# Altium schematic sheet RF.SchDoc
size A4
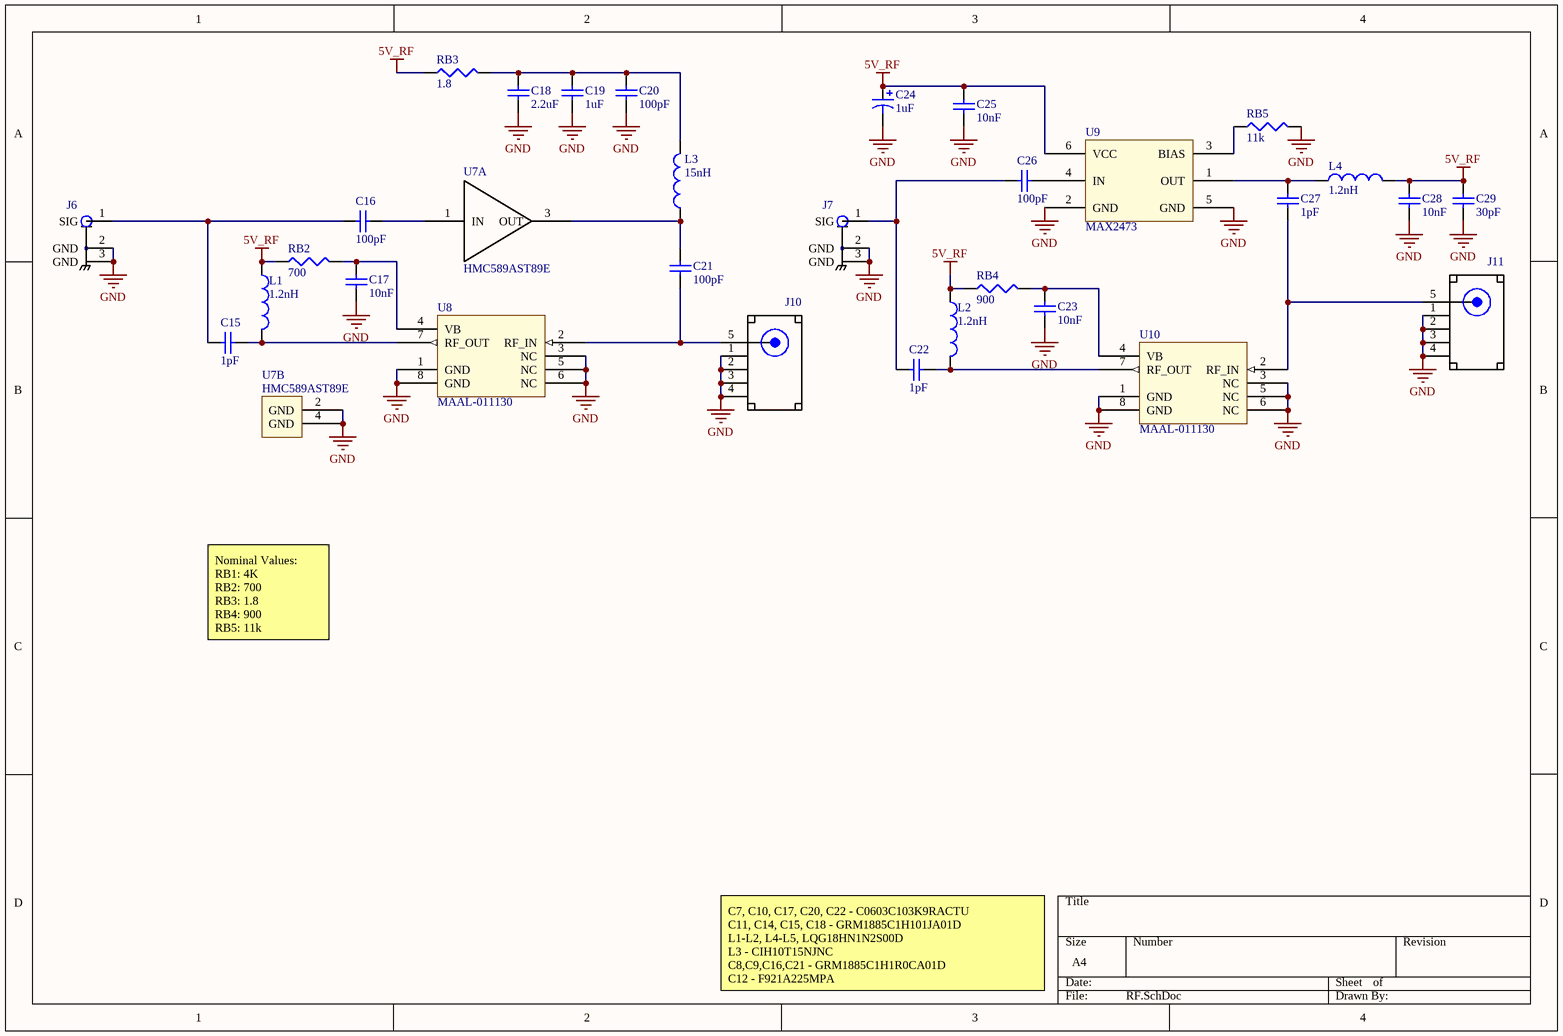
[diagram p0: RF.SchDoc]

## Parts
C15  1pF  [CAPC1608X90X35LL10T15]
C16  100pF  [CAPC0603(1608)100_N]
C17  10nF  [CAPC0603(1608)100_L]
C18  2.2uF  [C1206]
C19  1uF  [CAPC0603(1608)100_N]
C20  100pF  [CAPC0603(1608)100_N]
C21  100pF  [CAPC0603(1608)100_N]
C22  1pF  [CAPC1608X90X35LL10T15]
C23  10nF  [CAPC0603(1608)100_L]
C24  1uF  [CAPAE430X550N]
C25  10nF  [CAPC0603(1608)100_L]
C26  100pF  [CAPC0603(1608)100_N]
C27  1pF  [CAPC1608X90X35LL10T15]
C28  10nF  [CAPC0603(1608)100_L]
C29  30pF  [CAPC1608X90X35LL15T15]
J6  1909763-1  [TE_1909763-1]  (value not drawn)
J7  1909763-1  [TE_1909763-1]  (value not drawn)
J10  5-1814400-1  [CONN_5-1814400-1]  (value not drawn)
J11  5-1814400-1  [CONN_5-1814400-1]  (value not drawn)
L1  1.2nH  [INDC1608L]
L2  1.2nH  [INDC1608L]
L3  15nH  [INDC1608L]
L4  1.2nH  [INDC1608L]
RB2  700  [J1-0603]
RB3  1.8  [J1-0603]
RB4  900  [C1206]
RB5  11k  [J1-0603]
U7  HMC589AST89E  [SOT150P410X160-3N]  (parts A,B of 2)
U8  MAAL-011130  [PQFN50P200X200X100_HS-9N]
U9  MAX2473  [SOT95P280X145-6N]
U10  MAAL-011130  [PQFN50P200X200X100_HS-9N]

## Nets
5V_RF: C24.1 C25.2 C28.2 C29.2 L1.2 L2.2 L4.1 RB2.2 RB3.2 RB4.2 U9.6(VCC)
GND: C17.1 C18.1 C19.2 C20.2 C23.1 C24.2 C25.1 C28.1 C29.1 J6.2(GND) J6.3(GND) J7.2(GND) J7.3(GND) J10.1(GND) J10.2(GND) J10.3(GND) J10.4(GND) J11.1(GND) J11.2(GND) J11.3(GND) J11.4(GND) RB5.1 U7.2(GND) U7.4(GND) U8.1(GND) U8.3(NC) U8.5(NC) U8.6(NC) U8.8(GND) U9.2(GND) U9.5(GND) U10.1(GND) U10.3(NC) U10.5(NC) U10.6(NC) U10.8(GND)
NetC15_1: C15.1 C16.1 J6.1(SIG)
NetC15_2: C15.2 L1.1 U8.7(RF_OUT)
NetC16_2: C16.2 U7.1(IN)
NetC17_2: C17.2 RB2.1 U8.4(VB)
NetC18_2: C18.2 C19.1 C20.1 L3.1 RB3.1
NetC21_1: C21.1 L3.2 U7.3(OUT)
NetC21_2: C21.2 J10.5(SIGNAL) U8.2(RF_IN)
NetC22_1: C22.1 C26.1 J7.1(SIG)
NetC22_2: C22.2 L2.1 U10.7(RF_OUT)
NetC23_2: C23.2 RB4.1 U10.4(VB)
NetC26_2: C26.2 U9.4(IN)
NetC27_1: C27.1 J11.5(SIGNAL) U10.2(RF_IN)
NetC27_2: C27.2 L4.2 U9.1(OUT)
NetRB5_2: RB5.2 U9.3(BIAS)

## Notes on the sheet
- Nominal Values:
  RB1: 4K
  RB2: 700
  RB3: 1.8
  RB4: 900
  RB5: 11k
- C7, C10, C17, C20, C22 - C0603C103K9RACTU
  C11, C14, C15, C18 - GRM1885C1H101JA01D
  L1-L2, L4-L5, LQG18HN1N2S00D
  L3 - CIH10T15NJNC
  C8,C9,C16,C21 - GRM1885C1H1R0CA01D
  C12 - F921A225MPA

## Library data of the parts
C15 C22 C27 = CMP-2006-02464-1: Manufacturer: Murata; Part Number: GRM1885C1H1R0CA01D; Value: 1pF
  C27: Value2: *
C16 C19-C21 C26 = CMP-1035-01269-1: CAP 100pF 50V ±5% 0603 (1608 Metric) Thickness 1mm SMD; Case-EIA: 0603; Case-Metric: 1608; Tolerance: Â±5%; Max Thickness: 1 mm; Rated Voltage: 50 V; Technology: SMT
  C16 C20 C21 C26: Value: 100pF
  C19: Value: 1uF
C17 C23 C25 C28 = CMP-1035-02302-1: CAP 10nF 6.3V ±10% 0603 (1608 Metric) Thickness 1mm SMD; Case-EIA: 0603; Case-Metric: 1608; Tolerance: Â±10%; Value: 10nF; Max Thickness: 1 mm; Rated Voltage: 6.3 V; Technology: SMT
C18 = Cap Semi: Capacitor (Semiconductor SIM Model); Manufacturer: AVX; Part Number: F921A225MPA; Value: 2.2uF
C24 = Cap Pol3: Polarized Capacitor (Surface Mount); Manufacturer: Panasonic; Part Number: EEE-FC1H1R0R; Value: 1uF
C29 = CMP-2006-04292-1: Manufacturer: AVX Interconnect / Elco; Part Number: 06035A300JAT2A; Value: 30pF
J6 J7 = 1909763-1: CONN UMCC JACK STR 50OHM SMD; Number_of_Positions: 1; MF: TE Connectivity; Availability: Good; MP: 1909763-1; Price: 0.28 USD; Package: None; Value: *
J10 J11 = 5-1814400-1: SMA R/A PCB Skt GZD; Number_of_Positions: 1; MF: TE Connectivity; Digi-Key_Purchase_URL: https://www.digikey.com/product-detail/en/te-connectivity-amp-connectors/5-1814400-1/A97593-ND/1755981?WT.z_cid=ref_snapeda&utm_source=snapeda&utm_medium=aggregator&utm_campaign=buynow; Digi-Key_Part_Number: A97593-ND; EU_RoHS_Compliance: Compliant; Package: None; MP: 5-1814400-1; Link: http://www.te.com/usa-en/product-5-1814400-1.html; SnapEDA_Link: https://www.snapeda.com/symbols-footprints/5-1814400-1/TE%20Connectivity%20AMP%20Connectors/view-part/?ref=snap; Value: *
L1 L2 L4 = Inductor: Part Number: LQG15WH1N2S02D; Manufacturer: Murata; Value: 1.2nH
L3 = Inductor: Part Number: CIH10T15NJNC; Manufacturer: Samsung; Value: 15nH
RB2-RB5 = Res3: Resistor; Published: 8-Jun-2000; LatestRevisionDate: 29-May-2009; LatestRevisionNote: IPC-7351 Footprint Added.; PackageReference: J1-0603; Publisher: Altium Limited; PackageDescription: Chip Resistor
  RB2: Value: 700
  RB3: Value: 1.8
  RB4: Value: 900
  RB5: Value: 11k